# EAGLE design AnimatronicMouth (EAGLE 9.6.2)
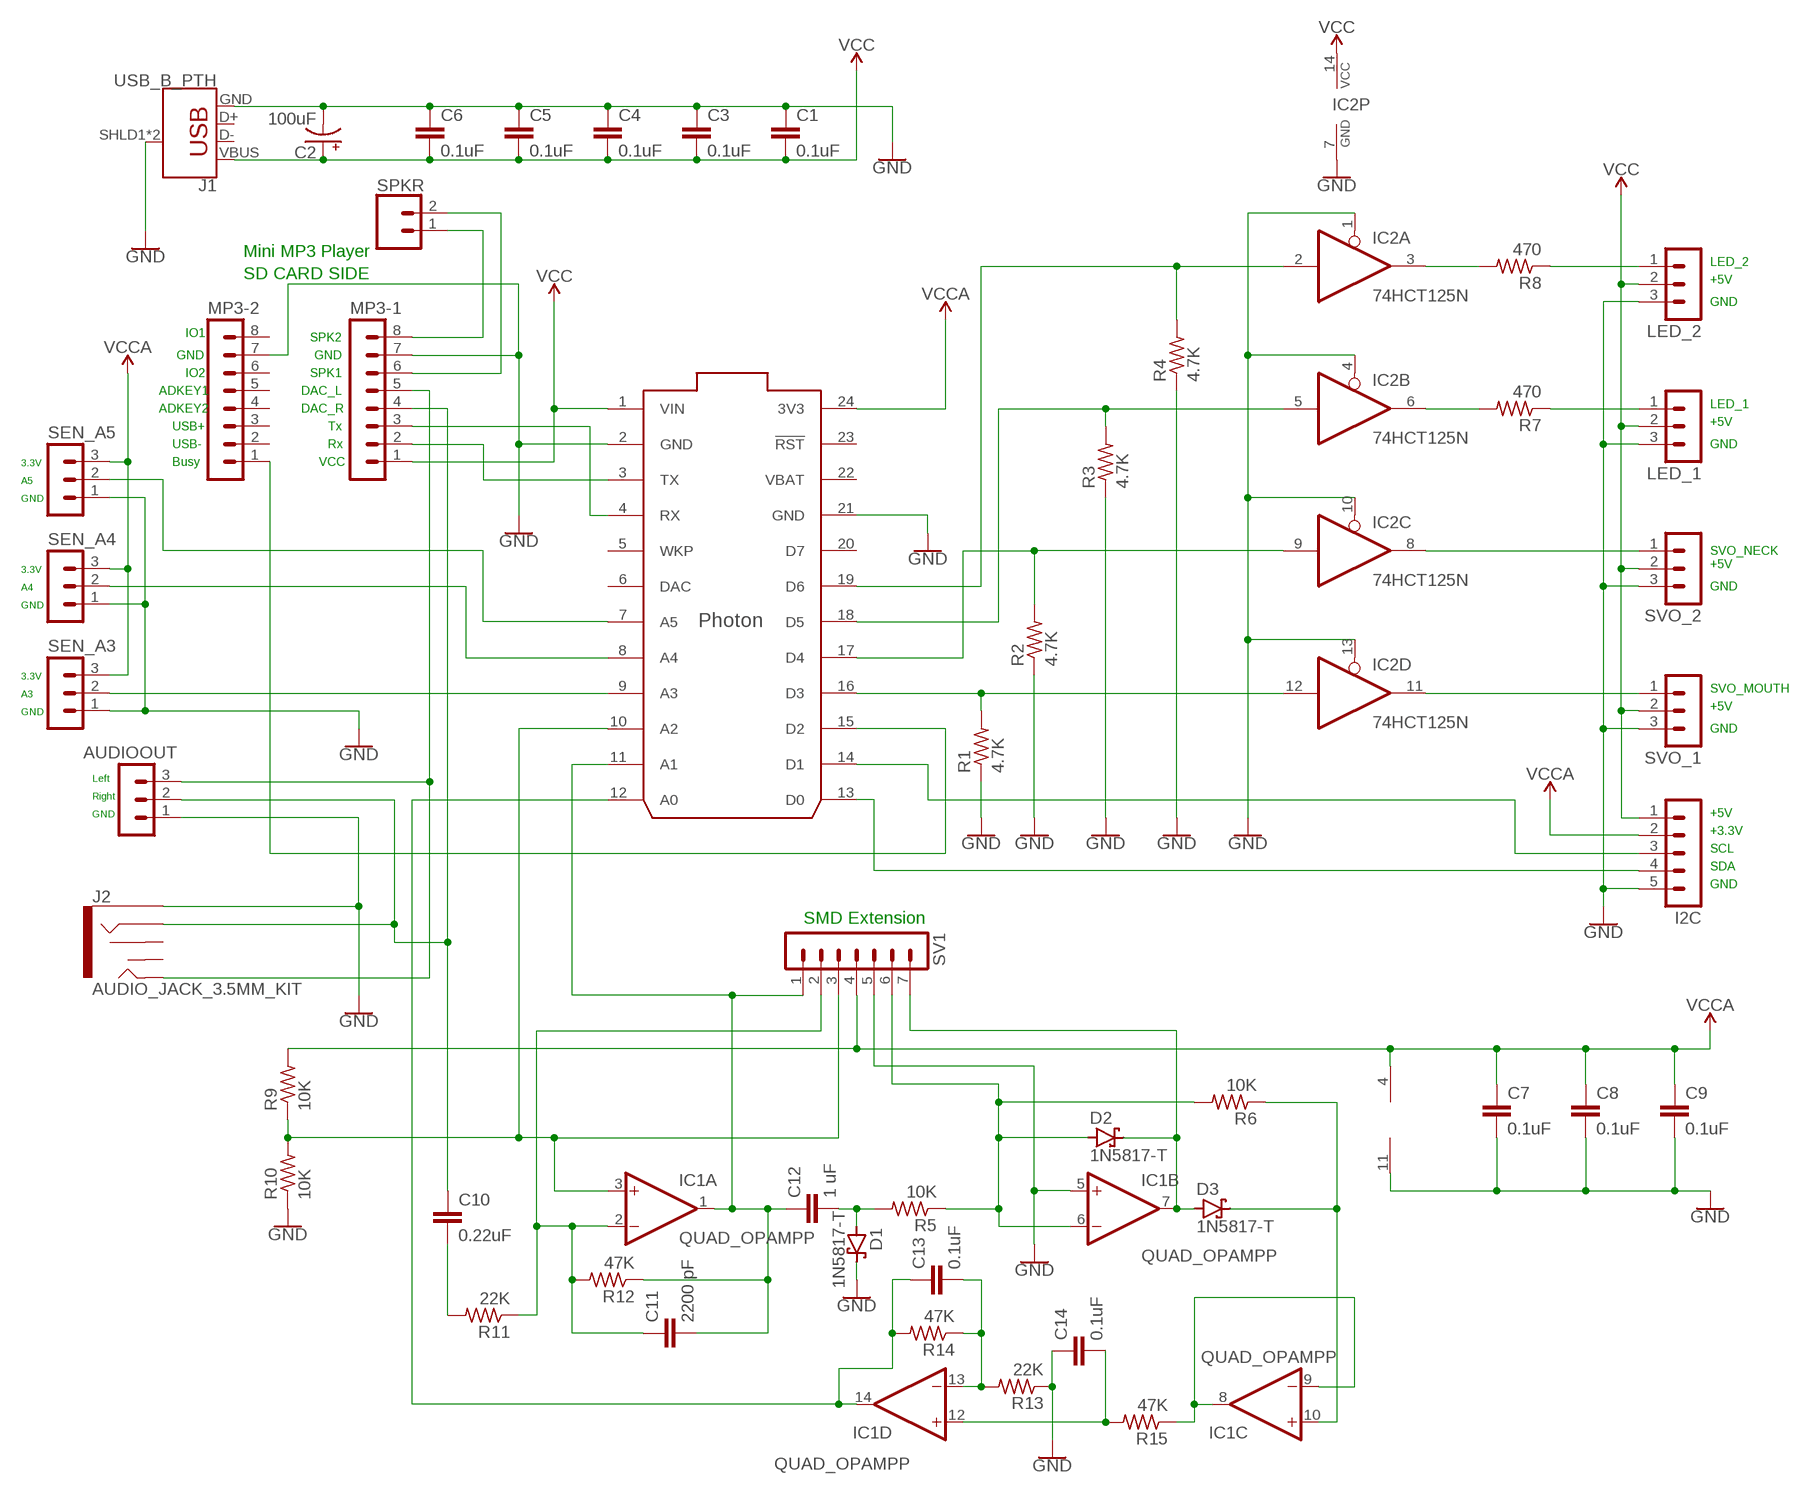
[diagram p0: schematic, sheet 1]

## Parts
AUDIOOUT  MA03-1  [MA03-1]
C1  0.1uF  0.1UF-KIT-EZ-50V-20%  [CAP-PTH-SMALL-KIT]
C2  100uF  100UF-POLAR-RADIAL-2.5MM-25V-20%  [CPOL-RADIAL-2.5MM-6.5MM]
C3  0.1uF  0.1UF-KIT-EZ-50V-20%  [CAP-PTH-SMALL-KIT]
C4  0.1uF  0.1UF-KIT-EZ-50V-20%  [CAP-PTH-SMALL-KIT]
C5  0.1uF  0.1UF-KIT-EZ-50V-20%  [CAP-PTH-SMALL-KIT]
C6  0.1uF  0.1UF-KIT-EZ-50V-20%  [CAP-PTH-SMALL-KIT]
C7  0.1uF  0.1UF-KIT-EZ-50V-20%  [CAP-PTH-SMALL-KIT]
C8  0.1uF  0.1UF-KIT-EZ-50V-20%  [CAP-PTH-SMALL-KIT]
C9  0.1uF  0.1UF-KIT-EZ-50V-20%  [CAP-PTH-SMALL-KIT]
C10  0.22uF  0.1UF-KIT-EZ-50V-20%  [CAP-PTH-SMALL-KIT]
C11  2200 pF  0.1UF-KIT-EZ-50V-20%  [CAP-PTH-SMALL-KIT]
C12  1 uF  0.1UF-KIT-EZ-50V-20%  [CAP-PTH-SMALL-KIT]
C13  0.1uF  0.1UF-KIT-EZ-50V-20%  [CAP-PTH-SMALL-KIT]
C14  0.1uF  0.1UF-KIT-EZ-50V-20%  [CAP-PTH-SMALL-KIT]
D1  1N5817-T  [DO41-7.6]
D2  1N5817-T  [DO41-7.6]
D3  1N5817-T  [DO41-7.6]
I2C  MA05-1  [MA05-1]
IC1  QUAD_OPAMPP  [DIL14]
IC2  74HCT125N  [DIL14]
J1  USB_B_PTH  [USB-B-PTH]
J2  AUDIO_JACK_3.5MM_KIT  [AUDIO-JACK-KIT]
LED_1  MA03-1  [MA03-1]
LED_2  MA03-1  [MA03-1]
MP3-1  MA08-1  [MA08-1]
MP3-2  MA08-1  [MA08-1]
R1  4.7K  R-US_0309/12  [0309/12]
R2  4.7K  R-US_0309/12  [0309/12]
R3  4.7K  R-US_0309/12  [0309/12]
R4  4.7K  R-US_0309/12  [0309/12]
R5  10K  R-US_0309/12  [0309/12]
R6  10K  R-US_0309/12  [0309/12]
R7  470  R-US_0309/12  [0309/12]
R8  470  R-US_0309/12  [0309/12]
R9  10K  R-US_0309/12  [0309/12]
R10  10K  R-US_0309/12  [0309/12]
R11  22K  R-US_0309/12  [0309/12]
R12  47K  R-US_0309/12  [0309/12]
R13  22K  R-US_0309/12  [0309/12]
R14  47K  R-US_0309/12  [0309/12]
R15  47K  R-US_0309/12  [0309/12]
SEN_A3  MA03-1  [MA03-1]
SEN_A4  MA03-1  [MA03-1]
SEN_A5  MA03-1  [MA03-1]
SPKR  CONN_023.5MM  [SCREWTERMINAL-3.5MM-2]
SV1  MA07-1  [MA07-1]
SVO_1  MA03-1  [MA03-1]
SVO_2  MA03-1  [MA03-1]
U$1  PHOTON_WITH_HEADERS  [PHOTON]

## Nets
GND: AUDIOOUT.1 C1.1 C2.2(-) C3.1 C4.1 C5.1 C6.1 C7.2 C8.2 C9.2 C14.1 D1.C I2C.5 IC1.5(B:+IN) IC1.11(P:V-) IC2.1(A:OE) IC2.4(B:OE) IC2.7(P:GND) IC2.10(C:OE) IC2.13(D:OE) J1.GND J1.SHLD1(SHIELD) J1.SHLD2(SHIELD) J2.SLEEVE LED_1.3 LED_2.3 MP3-1.7 MP3-2.7 R1.1 R2.1 R3.1 R4.1 R10.1 R13.1 SEN_A3.1 SEN_A4.1 SEN_A5.1 SV1.5 SVO_1.3 SVO_2.3 U$1.2(GND) U$1.21(GND)
N$1: IC2.12(D:I) R1.2 U$1.16(D3)
N$2: IC2.5(B:I) R3.2 U$1.18(D5)
N$3: IC2.9(C:I) R2.2 U$1.17(D4)
N$4: IC2.2(A:I) R4.2 U$1.19(D6)
N$5: IC2.11(D:O) SVO_1.1
N$6: LED_2.1 R8.1
N$7: IC2.8(C:O) SVO_2.1
N$8: LED_1.1 R7.1
N$9: IC2.6(B:O) R7.2
N$10: I2C.4 U$1.13(D0)
N$11: IC2.3(A:O) R8.2
N$12: MP3-1.6 SPKR.2
N$13: C11.2 C12.1 IC1.1(A:OUT) R12.1 SV1.1 U$1.11(A1)
N$14: IC1.3(A:+IN) R9.1 R10.2 SV1.3 U$1.10(A2)
N$15: AUDIOOUT.2 C10.1 J2.RING MP3-1.4
N$16: C12.2 D1.A R5.2
N$17: D2.A IC1.6(B:-IN) R5.1 R6.2 SV1.6
N$18: D2.C D3.A IC1.7(B:OUT) SV1.7
N$19: C13.1 IC1.14(D:OUT) R14.2 U$1.12(A0)
N$20: C10.2 R11.2
N$21: C11.1 IC1.2(A:-IN) R11.1 R12.2 SV1.2
N$22: MP3-1.2 U$1.3(TX)
N$23: MP3-1.3 U$1.4(RX)
N$24: MP3-2.1 U$1.15(D2)
N$25: AUDIOOUT.3 J2.TIP MP3-1.5
N$26: I2C.3 U$1.14(D1)
N$27: MP3-1.8 SPKR.1
N$28: SEN_A5.2 U$1.7(A5)
N$29: D3.C IC1.10(C:+IN) R6.1
N$30: SEN_A3.2 U$1.9(A3)
N$31: SEN_A4.2 U$1.8(A4)
N$33: C13.2 IC1.13(D:-IN) R13.2 R14.1
N$34: C14.2 IC1.12(D:+IN) R15.2
N$35: IC1.8(C:OUT) IC1.9(C:-IN) R15.1
VCC: C1.2 C2.1(+) C3.2 C4.2 C5.2 C6.2 I2C.1 IC2.14(P:VCC) J1.VBUS LED_1.2 LED_2.2 MP3-1.1 SVO_1.2 SVO_2.2 U$1.1(VIN)
VCCA: C7.1 C8.1 C9.1 I2C.2 IC1.4(P:V+) R9.2 SEN_A3.3 SEN_A4.3 SEN_A5.3 SV1.4 U$1.24(3V3)
Unconnected: J1.D+ J1.D- J2.RSH J2.TSH MP3-2.2 MP3-2.3 MP3-2.4 MP3-2.5 MP3-2.6 MP3-2.8 U$1.5(WKP) U$1.6(DAC) U$1.20(D7) U$1.23(!RST)

## Notes on the sheet
- Mini MP3 Player
- LED_2
- SD CARD SIDE
- +5V
- GND
- IO1
- SPK2
- GND | GND
- IO2 | SPK1
- ADKEY1 | DAC_L
- LED_1
- ADKEY2 | DAC_R
- +5V
- USB+ | Tx
- USB- | Rx | GND
- 3.3V | Busy | VCC
- A5
- GND
- SVO_NECK
- +5V
- 3.3V
- A4 | GND
- GND
- 3.3V
- SVO_MOUTH
- A3
- +5V
- GND
- GND
- Left
- Right
- GND | +5V
- +3.3V
- SCL
- SDA
- GND
- SMD Extension

## Power pins joined to a net without a drawn wire
VBAT: U$1.22(VBAT)

## Library data of the parts
AUDIOOUT LED_1 LED_2 SEN_A3-SEN_A5 SVO_1 SVO_2 = con-lstb:MA03-1: PIN HEADER; OC_FARNELL: unknown; OC_NEWARK: unknown
C1 C3-C9 C13 C14 = SparkFun-Capacitors:0.1UF: 0.1µF ceramic capacitors A capacitor is a passive two-terminal electrical component used to store electrical energy temporarily in an electric field.; PROD_ID: CAP-08370
C2 = SparkFun-Capacitors:100UF-POLAR: 100µF polarized capacitors A capacitor is a passive two-terminal electrical component used to store electrical energy temporarily in an electric field.; PROD_ID: CAP-08439
C10-C12 = SparkFun-Capacitors:0.1UF: 0.1µF ceramic capacitors A capacitor is a passive two-terminal electrical component used to store electrical energy temporarily in an electric field.; PROD_ID: CAP-08370; VALUE: 0.1uF
D1-D3 = diode:1N581*: 1.0A SCHOTTKY BARRIER RECTIFIER Source: http://www.diodes.com/datasheets/ds23001.pdf
I2C = con-lstb:MA05-1: PIN HEADER; OC_FARNELL: unknown; OC_NEWARK: unknown
IC1 = adafruit:QUAD_OPAMP: OP AMP Standard quad package
IC2 = 74xx-eu:74*125: Quad bus BUFFER, 3-state
J1 = SparkFun-Connectors:USB_B: USB Type B Connector SparkFun Products: SparkFun Stepoko <https://www.sparkfun.com/products/13899> PTH; PROD_ID: CONN-08278; SF_ID: PRT-00139
J2 = SparkFun-Connectors:AUDIO_JACK_3.5MM: Audio Jack 3.5mm variants of PTH and SMT stereo audio jack with bypass switches. SparkFun Products: SparkFun SparkPunk Sound Kit <[https://www.sparkfun.com/products/11177]> - PTH MP3 Trigger <https://www.sparkfun.com/products/13720> -3.5mm SMD SparkFun PicoBoard <https://www.sparkfun.com/products/11888>- 2.5mm SMD; PROD_ID: CONN-08774; SF_ID: PRT-08032
MP3-1 MP3-2 = con-lstb:MA08-1: PIN HEADER; OC_FARNELL: unknown; OC_NEWARK: unknown
R1-R15 = rcl:R-US_: RESISTOR, American symbol; SPICEPREFIX: R
SPKR = SparkFun-Connectors:CONN_02: Multi connection point. Often used as Generic Header-pin footprint for 0.1 inch spaced/style header connections On any of the 0.1 inch spaced packages, you can populate with these: Break Away Headers - Straight <https://www.sparkfun.com/products/116> (PRT-00116) Break Away Male Headers - Right Angle <https://www.sparkfun.com/products/553> (PRT-00553) Female Headers <https://www.sparkfun.com/products/115> (PRT-00115) Break Away Headers - Machine Pin <https://www.sparkfun.com/products/117> (PRT-00117) Break Away Female Headers - Swiss Machine Pin <https://www.sparkfun.com/products/743> (PRT-00743) For SCREWTERMINALS and SPRING TERMINALS visit here: Screw Terimnals on SparkFun.com <https://www.sparkfun.com/search/results?term=Screw+Terminals> (5mm/3.5mm/2.54mm spacing) This device is also useful as a general connection point to wire up your design to another part of your project. Our various solder wires solder well into these plated through hole pads. Hook-Up Wire - Assortment (Stranded, 22 AWG) <https://www.sparkfun.com/products/11375> (PRT-11375) Hook-Up Wire - Assortment (Solid Core, 22 AWG) <https://www.sparkfun.com/products/11367> (PRT-11367) View the entire wire category on our website here <https://www.sparkfun.com/categories/141> Special notes: Molex polarized connector foot print use with: PRT-08233 with associated crimp pins and housings. 2.54_SCREWTERM for use with PRT-10571. 3.5mm Screw Terminal footprints for PRT-08084 5mm Screw Terminal footprints for use with PRT-08432; PROD_ID: CONN-08399
SV1 = con-lstb:MA07-1: PIN HEADER; OC_FARNELL: unknown; OC_NEWARK: unknown
U$1 = Particle-Devices:PHOTON: Particle Photon Wi-Fi through-hole development board footprint Product datasheet: here <https://docs.particle.io/datasheets/photon-(wifi)/photon-datasheet/> Design files: here <https://github.com/particle-iot/photon> Github : Particle devices library <https://github.com/particle-iot/hardware-libraries/tree/master/Eagle>

## Board
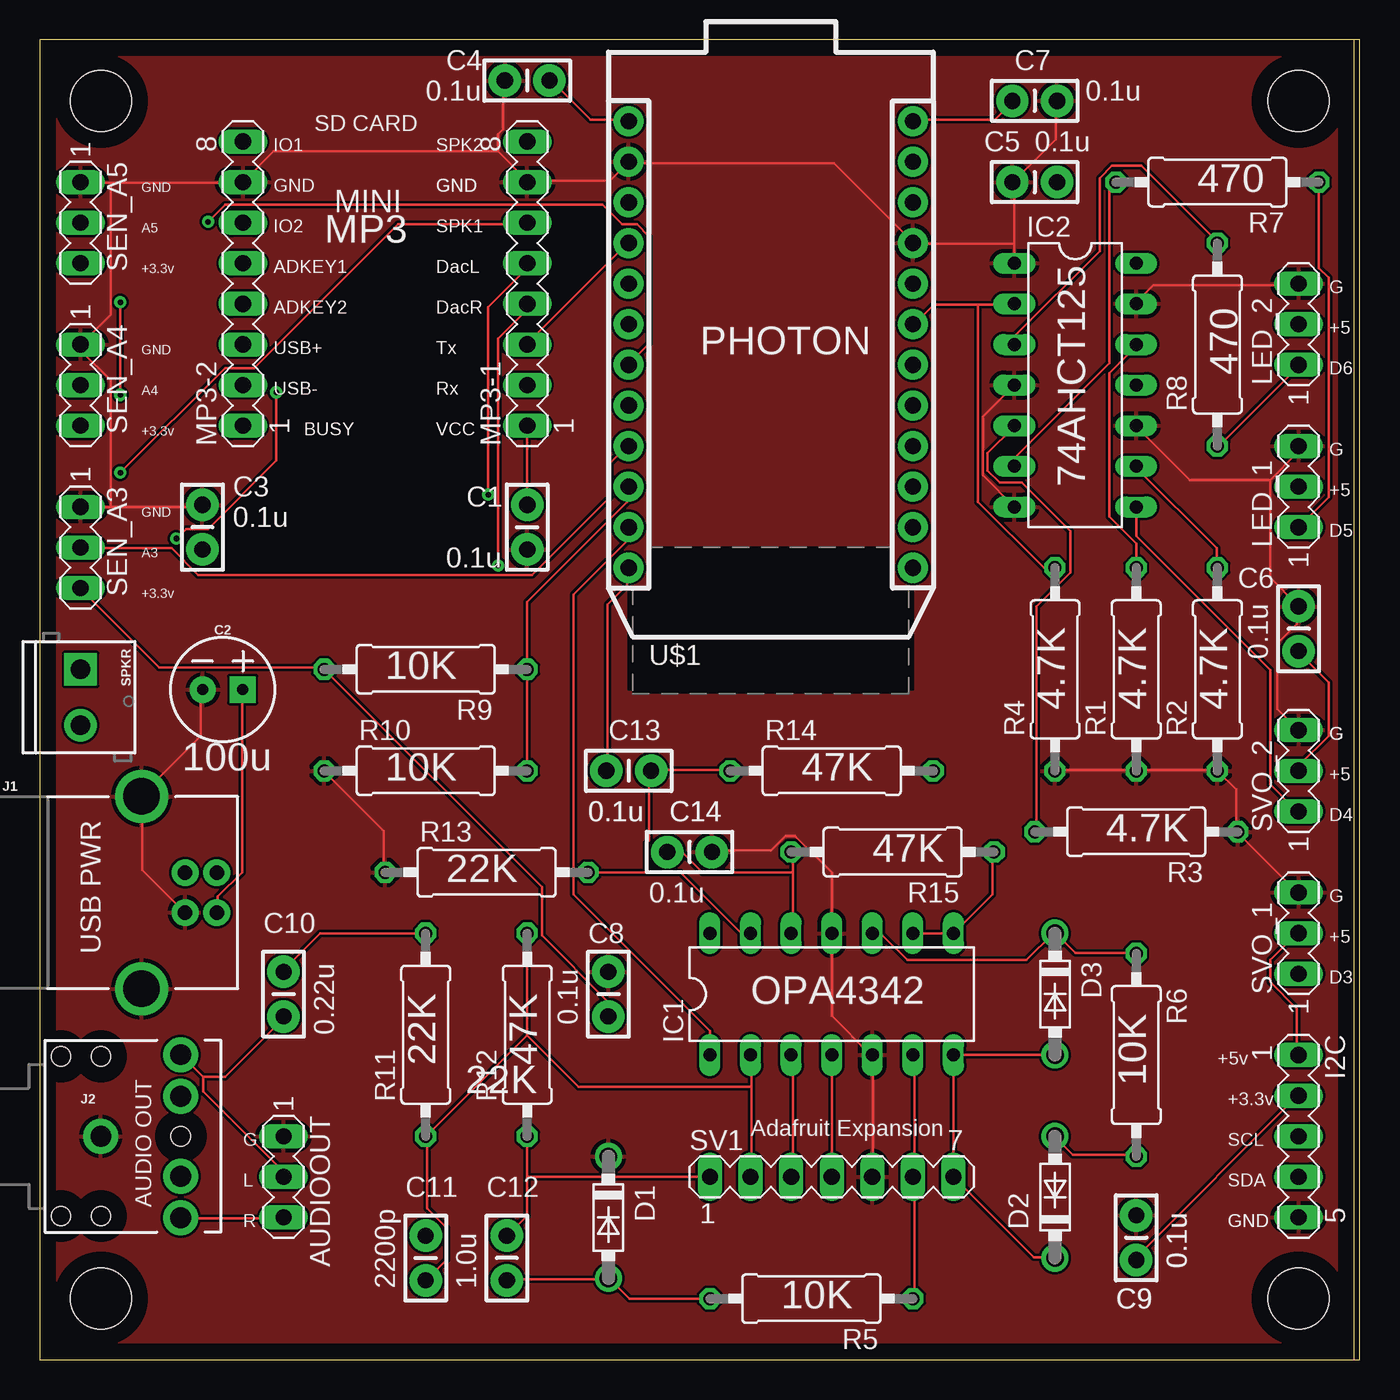
[diagram p1: board, top side]
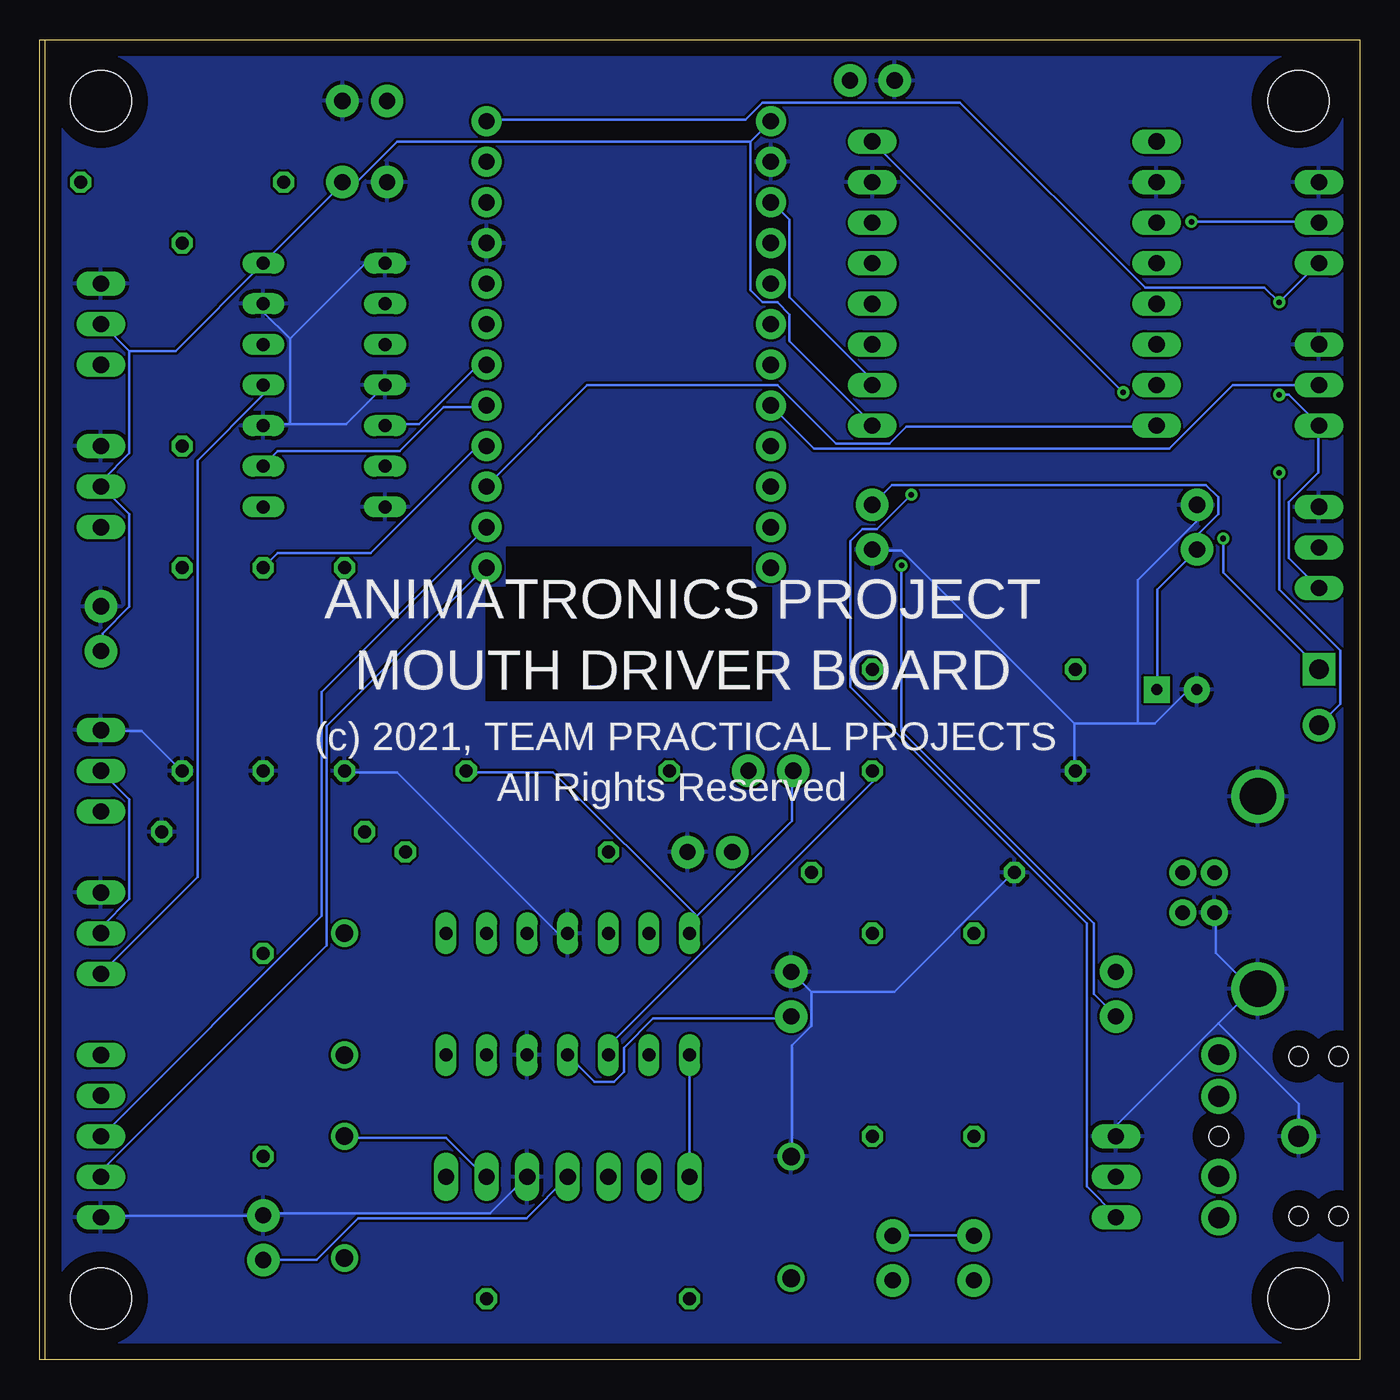
[diagram p2: board, bottom side, seen from below]

Size 82.55 x 82.55 mm. Coordinates in mm from the lower left corner, seen from the top.
Outline: 82.22,0 0,0 0,82.54 0,82.55 82.55,82.55 82.55,0 82.22,0
Outline: 82.22,0 82.22,82.54
Copper layers (1*16): Top 0.035mm / dielectric 1.5mm / Bottom 0.035mm
Design rules "default": minimum track width 6mil, minimum drill 0.35mm, track to track 6mil, track to pad 6mil, pad to pad 6mil, via to via 6mil, smd to smd 6mil, copper to edge 40mil, drill to drill 6mil, minimum pad ring 10mil, minimum via ring 8mil, stop-mask expansion 4mil, vias tented up to drill 0mil, thermal gap 10mil
Holes 3.8 mm at 3.81,78.74 3.81,3.81 78.74,3.81 78.74,78.74
tRestrict: area 53.3,41.9 to 54.6,48.3; area 36.8,41.9 to 54.6,50.8
bRestrict: area 36.8,41.3 to 54.6,50.8

### Footprints (pad centres in the part's own frame; a part is rotated, then mirrored left to right if it is on the bottom)
MA03-1 = drill 1.016 long: 1 -2.54,0; 2 0,0; 3 2.54,0
CAP-PTH-SMALL-KIT = drill 1.016 pad 2.032: 1 -1.397,0; 2 1.397,0
CPOL-RADIAL-2.5MM-6.5MM = drill 0.7 pad 1.651 square: 1 1.25,0 | drill 0.7 pad 1.651: 2 -1.25,0
DO41-7.6 = drill 1.1 pad 1.7: A 3.81,0; C -3.81,0
MA05-1 = drill 1.016 long: 1 -5.08,0; 2 -2.54,0; 3 0,0; 4 2.54,0; 5 5.08,0
DIL14 = drill 0.813 long: 1 -7.62,-3.81; 2 -5.08,-3.81; 3 -2.54,-3.81; 4 0,-3.81; 5 2.54,-3.81; 6 5.08,-3.81; 7 7.62,-3.81; 8 7.62,3.81; 9 5.08,3.81; 10 2.54,3.81; 11 0,3.81; 12 -2.54,3.81; 13 -5.08,3.81; 14 -7.62,3.81
USB-B-PTH = drill 0.914 pad 1.676: D+ 4,1.25; D- 5.981,1.25; GND 4,-1.25; VBUS 5.981,-1.25 | drill 2.286: SHLD1 1.282,-6.02; SHLD2 1.282,6.02
AUDIO-JACK-KIT = drill 1.3 pad 2.184: RING 5,5.1; RSH 5,2.5; SLEEVE 0,0; TIP 5,-5.1; TSH 5,-2.5 | hole 1.2: 0,5; -2.5,5; -2.5,-5; 0,-5; 5,0
MA08-1 = drill 1.016 long: 1 -8.89,0; 2 -6.35,0; 3 -3.81,0; 4 -1.27,0; 5 1.27,0; 6 3.81,0; 7 6.35,0; 8 8.89,0
0309/12 = drill 0.813 octagon: 1 -6.35,0; 2 6.35,0
SCREWTERMINAL-3.5MM-2 = drill 1.2 pad 2.032 square: 1 0,0 | drill 1.2 pad 2.032: 2 3.5,0
MA07-1 = drill 1.016 long: 1 -7.62,0; 2 -5.08,0; 3 -2.54,0; 4 0,0; 5 2.54,0; 6 5.08,0; 7 7.62,0
PHOTON = drill 1.016 pad 1.88: 1 1.27,33.02; 2 1.27,30.48; 3 1.27,27.94; 4 1.27,25.4; 5 1.27,22.86; 6 1.27,20.32; 7 1.27,17.78; 8 1.27,15.24; 9 1.27,12.7; 10 1.27,10.16; 11 1.27,7.62; 12 1.27,5.08; 13 19.05,5.08; 14 19.05,7.62; 15 19.05,10.16; 16 19.05,12.7; 17 19.05,15.24; 18 19.05,17.78; 19 19.05,20.32; 20 19.05,22.86; 21 19.05,25.4; 22 19.05,27.94; 23 19.05,30.48; 24 19.05,33.02

### Placement (x,y rotation side)
AUDIOOUT  15.24,11.43 270 top
C1  30.48,52.07 90 top
C2  11.43,41.91 0 top
C3  10.16,52.07 270 top
C4  30.48,80.01 0 top
C5  62.23,73.66 0 top
C6  78.74,45.72 270 top
C7  62.23,78.74 0 top
C8  35.56,22.86 90 top
C9  68.58,7.62 90 top
C10  15.24,22.86 90 top
C11  24.13,6.35 90 top
C12  29.21,6.35 270 top
C13  36.83,36.83 0 top
C14  40.64,31.75 180 top
D1  35.56,8.89 270 top
D2  63.5,10.16 90 top
D3  63.5,22.86 270 top
I2C  78.74,13.97 270 top
IC1  49.53,22.86 0 top
IC2  64.77,60.96 270 top
J1  5.08,29.21 0 top
J2  3.81,13.97 0 top
LED_1  78.74,54.61 90 top
LED_2  78.74,64.77 90 top
MP3-1  30.48,67.31 90 top
MP3-2  12.7,67.31 90 top
R1  68.58,43.18 90 top
R2  73.66,43.18 90 top
R3  68.58,33.02 180 top
R4  63.5,43.18 90 top
R5  48.26,3.81 180 top
R6  68.58,19.05 270 top
R7  73.66,73.66 180 top
R8  73.66,63.5 90 top
R9  24.13,43.18 180 top
R10  24.13,36.83 0 top
R11  24.13,20.32 90 top
R12  30.48,20.32 90 top
R13  27.94,30.48 0 top
R14  49.53,36.83 0 top
R15  53.34,31.75 180 top
SEN_A3  2.54,50.8 270 top
SEN_A4  2.54,60.96 270 top
SEN_A5  2.54,71.12 270 top
SPKR  2.54,43.18 270 top
SV1  49.53,11.43 0 top
SVO_1  78.74,26.67 90 top
SVO_2  78.74,36.83 90 top
U$1  35.56,44.45 0 top

### Tracks (layer width: path | path; a pad name or v marks a point on that pad's centre or on a via)
GND
  Top 0.152: 30.48,73.76 35.66,73.76 U$1.2 36.88,74.83 49.68,74.83 54.56,69.95 U$1.21 54.71,69.8 60.96,69.8 | 28.65,75.59 28.65,76.66 28.96,76.96 28.96,80.01 C4.1 | 30.48,73.76 28.65,75.59 | 30.48,73.76 MP3-1.7 | 4.42,73.61 12.65,73.61 MP3-2.7 14.63,75.59 28.65,75.59 | 4.42,73.61 2.59,73.61 SEN_A5.1 | 4.42,53.34 10.06,53.34 C3.1 | 4.42,53.34 SEN_A3.1 | 4.42,53.34 4.42,61.27 2.59,63.09 2.59,63.4 SEN_A4.1 4.42,65.38 4.42,73.61 | C2.2 10.06,41.91 10.06,39.01 6.4,35.36 J1.SHLD2 6.4,35.2 6.4,30.63 8.99,28.04 J1.GND | R13.1 21.49,30.48 21.49,33.07 17.83,36.73 R10.1 | SV1.5 52.12,11.43 52.12,19.05 IC1.5 51.97,19.05 49.53,21.49 IC1.11 49.53,30.48 47.24,32.77 46.63,32.77 45.72,31.85 42.06,31.85 C14.1 | 76.96,55.02 78.64,56.69 78.64,57.15 LED_1.3 | 76.96,55.02 76.96,48.92 78.64,47.24 C6.1 78.64,47.09 78.64,46.02 77.42,44.81 77.42,40.69 SVO_2.3 | 68.58,36.88 63.55,36.88 R4.1 | SVO_1.3 78.64,29.26 74.98,32.92 R3.1 74.83,33.07 74.83,35.66 R2.1 73.61,36.88 68.58,36.88 | 68.58,36.88 R1.1 | 60.96,69.8 60.96,73.61 C5.1 60.96,73.76 63.55,76.35 63.55,78.64 C7.2 | 60.96,69.8 IC2.1 | IC2.7 58.98,55.32 58.98,58.98 IC2.4 | LED_2.3 78.64,67.21 69.65,67.21 68.58,66.14 IC2.13 | 76.96,55.02 71.93,55.02 68.58,58.37 IC2.10
  Bottom 0.152: AUDIOOUT.1 15.24,14.63 8.84,21.03 | 6.71,23.16 8.84,21.03 | 6.71,23.16 6.4,23.16 J1.SHLD1 6.71,23.16 | 6.71,23.16 8.99,25.45 8.99,27.89 J1.GND | J2.SLEEVE 3.81,16 8.84,21.03 | 34.29,23.01 34.29,20.88 35.51,19.66 35.51,12.8 D1.C | 34.29,23.01 35.51,24.23 C8.2 | 17.83,39.78 28.65,50.6 30.48,50.6 C1.1 | 17.83,39.78 17.83,36.88 R10.1 | 34.29,23.01 29.11,23.01 21.64,30.48 R13.1 | C2.2 10.67,41.91 12.8,39.78 13.87,39.78 | 17.83,39.78 13.87,39.78 | 13.87,39.78 13.87,48.77 10.21,52.43 10.21,53.34 C3.1 | I2C.5 78.64,8.99 68.58,8.99 C9.2 68.58,9.14 54.41,9.14 52.12,11.43 SV1.5 | SVO_2.3 78.64,39.32 76.2,39.32 73.76,36.88 R2.1 | 66.9,58.52 63.4,58.52 IC2.4 | 66.9,58.52 68.58,58.52 IC2.10 | IC2.13 68.58,65.53 66.9,63.86 | 66.9,58.52 66.9,63.86 | IC2.1 62.18,68.58 66.9,63.86 | IC1.11 50.14,26.67 60.2,36.73 63.4,36.73 R4.1
  pour Top: 0,82.55 0,0 82.55,0 82.55,82.55
  pour Bottom: 0,82.55 0,0 82.55,0 82.55,82.55
N$1
  Top 0.152: R1.2 68.58,51.05 66.9,52.73 66.9,61.72 68.58,63.4 IC2.12
  Bottom 0.152: U$1.16 55.17,57.15 61.87,50.44 67.67,50.44 R1.2
N$2
  Top 0.152: R3.2 62.33,33.07 62.33,47.09 64.47,49.23 64.47,51.82 61.42,54.86 60.05,54.86 59.28,55.63 59.28,56.69 60.96,58.37 IC2.5
  Bottom 0.152: IC2.5 60.96,58.52 58.83,58.52 55.17,62.18 54.71,62.18 U$1.18
N$3
  Top 0.152: R2.2 73.61,49.53 73.61,50.75 68.58,55.78 IC2.9
  Bottom 0.152: U$1.17 54.71,59.59 57.3,59.59 60.05,56.84 67.67,56.84 68.58,55.93 IC2.9
N$4
  Top 0.152: 58.67,65.99 55.93,65.99 54.71,64.77 U$1.19 | 58.67,65.99 60.96,65.99 IC2.2 | R4.2 62.79,49.53 58.67,53.65 58.67,65.99
N$5
  Bottom 0.152: IC2.11 68.58,60.35 72.69,56.24 72.69,30.18 SVO_1.1
N$6
  Top 0.152: R8.1 73.76,57.15 78.79,62.18 LED_2.1
N$7
  Top 0.152: IC2.8 68.58,51.51 76.96,43.13 76.96,35.97 78.64,34.29 SVO_2.1
N$8
  Top 0.152: R7.1 80.01,68.28 80.62,67.67 80.62,53.95 LED_1.1
N$9
  Top 0.152: IC2.6 60.96,56.39 66.9,62.33 66.9,73.3 67.21,73.61 R7.2
N$10
  Bottom 0.152: I2C.4 78.64,11.43 78.64,11.89 64.62,25.91 64.62,39.62 54.71,49.53 U$1.13
N$11
  Top 0.152: IC2.3 60.96,64.01 66.29,69.34 66.29,73.91 67.06,74.68 68.89,74.68 73.61,69.95 R8.2
N$12  (via drill 0.35)
  Top 0.152: v5.03,55.47 11.58,62.03 13.41,62.03 22.4,71.02 30.48,71.02 MP3-1.6
  Bottom 0.152: v5.03,55.47 5.03,48.16 1.22,44.35 1.22,41 2.44,39.78 SPKR.2
N$13
  Top 0.152: 30.48,11.43 30.48,8.99 29.26,7.77 C12.1 | 30.48,11.43 R12.1 | IC1.1 41.91,20.57 33.38,29.11 33.38,47.85 36.73,51.21 36.73,51.97 U$1.11 | SV1.1 30.48,11.43
  Bottom 0.152: C11.2 24.23,7.77 29.11,7.77 C12.1 | SV1.1 IC1.1
N$14
  Top 0.152: IC1.3 47.09,19.05 47.09,11.43 SV1.3 | R10.2 R9.1 30.48,47.4 36.73,53.65 36.73,54.56 U$1.10
  Bottom 0.152: R10.2 30.48,36.12 46.94,19.66 46.94,19.05 IC1.3
N$15  (via drill 0.35)
  Top 0.152: AUDIOOUT.2 15.24,11.73 10.21,16.76 10.21,17.68 | 10.21,17.68 8.84,19.05 J2.RING | MP3-1.4 30.48,65.68 28.65,63.86 v28.65,49.68 | 10.21,17.68 11.58,17.68 15.24,21.34 C10.1
  Bottom 0.152: v28.65,49.68 28.65,39.32 16.61,27.28 16.61,22.86 15.24,21.49 C10.1
N$16
  Top 0.152: R5.2 36.88,3.81 35.66,5.03 D1.A 35.51,5.03 29.26,5.03 C12.2
N$17
  Top 0.152: R6.2 68.58,12.8 64.62,12.8 63.55,13.87 D2.A | 54.71,11.43 54.71,3.81 R5.1 | 54.71,11.43 54.71,19.05 IC1.6 | 54.71,11.43 SV1.6
  Bottom 0.152: D2.A 63.4,13.87 57.15,13.87 54.71,11.43 SV1.6
N$18
  Top 0.152: D3.A IC1.7 SV1.7 62.18,6.4 63.4,6.4 D2.C
N$19
  Top 0.152: U$1.12 36.73,49.53 36.73,48.46 35.51,47.24 35.51,36.88 C13.1
  Bottom 0.152: 41.45,27.74 35.51,33.68 35.51,36.73 C13.1 | 41.45,27.74 41.91,27.28 IC1.14 41.45,27.74 | 41.45,27.74 50.44,36.73 55.78,36.73 R14.2
N$20
  Top 0.152: R11.2 17.53,26.67 15.24,24.38 C10.2
N$21
  Top 0.152: 44.5,17.07 44.5,11.43 SV1.2 | 44.5,17.07 44.5,19.05 IC1.2 | C11.1 24.23,5.03 25.45,6.25 25.45,8.23 24.23,9.45 24.23,13.87 R11.1 24.23,14.02 30.48,20.27 | 30.48,20.27 R12.2 | 44.5,17.07 33.68,17.07 30.48,20.27
N$22
  Bottom 0.152: MP3-1.2 30.48,61.27 35.66,66.45 35.66,71.32 36.73,72.39 U$1.3
N$23
  Top 0.152: MP3-1.3 30.48,63.55 36.73,69.8 U$1.4
N$24
  Bottom 0.152: MP3-2.1 12.8,58.37 28.35,58.37 29.41,57.3 32.77,57.3 36.42,60.96 48.31,60.96 54.56,54.71 U$1.15
N$25  (via drill 0.35)
  Top 0.152: AUDIOOUT.3 15.24,8.84 8.84,8.84 J2.TIP | MP3-1.5 30.48,68.28 28.04,65.84 v28.04,54.1
  Bottom 0.152: v28.04,54.1 30.18,51.97 31.09,51.97 31.85,51.21 31.85,42.06 17.07,27.28 17.07,10.82 15.24,8.99 AUDIOOUT.3
N$26
  Bottom 0.152: U$1.14 64.92,41.76 64.92,27.74 78.64,14.02 I2C.3
N$27  (via drill 0.35)
  Top 0.152: v14.78,60.5 14.78,56.24 10.52,51.97 9.14,51.97 v8.53,51.36
  Bottom 0.152: v14.78,60.5 MP3-1.8 | v8.53,51.36 8.53,49.23 2.59,43.28 SPKR.1
N$28  (via drill 0.35)
  Top 0.152: v10.52,71.17 11.58,72.24 35.2,72.24 36.42,71.02 37.34,71.02 38.1,70.26 38.1,63.55 36.88,62.33 U$1.7
  Bottom 0.152: v10.52,71.17 2.59,71.17 SEN_A5.2
N$29
  Top 0.152: R6.1 68.58,25.45 64.77,25.45 63.55,26.67 D3.C 63.4,26.67 61.72,24.99 54.25,24.99 52.58,26.67 IC1.10
N$30
  Top 0.152: SEN_A3.2 2.59,50.75 8.23,50.75 9.91,49.07 30.79,49.07 35.66,53.95 35.66,56.08 36.73,57.15 U$1.9
N$31
  Bottom 0.152: SEN_A4.2 7.92,60.96 11.89,57 34.14,57 U$1.8
N$33
  Top 0.152: R14.1 43.13,36.88 38.25,36.88 C13.2 38.1,36.73 38.1,32.46 37.95,32.31 37.95,30.48 | IC1.13 43.89,26.67 40.08,30.48 37.95,30.48 | R13.2 37.95,30.48
N$34
  Top 0.152: 47.09,30.48 47.09,31.7 R15.2 | 47.09,30.48 47.09,26.67 IC1.12 | 47.09,30.48 41.45,30.48 40.23,31.7 39.32,31.7 C14.2
N$35
  Top 0.152: IC1.9 IC1.8 59.59,29.11 59.59,31.7 R15.1
VCC
  Top 0.152: I2C.1 78.64,19.05 78.64,21.95 76.96,23.62 76.96,24.99 78.64,26.67 SVO_1.2 | SVO_2.2 78.79,36.88 78.79,37.19 80.62,39.01 80.62,42.37 78.79,44.2 C6.2 | J1.VBUS 11.12,28.04 11.12,28.96 12.65,30.48 12.65,41.91 C2.1 | C1.2 MP3-1.1 | U$1.1 36.73,77.57 34.44,77.57 32,80.01 C4.2
  Bottom 0.152: SVO_2.2 76.96,35.05 76.96,28.8 78.64,27.13 78.64,26.67 SVO_1.2 | 76.96,63.09 76.96,56.69 78.64,55.02 78.64,54.71 LED_1.2 78.64,54.56 76.96,52.88 76.96,47.09 78.64,45.41 78.64,44.35 C6.2 | 76.96,63.09 78.64,64.77 LED_2.2 | 76.96,63.09 74.07,63.09 IC2.14 63.55,73.61 C5.2 63.55,73.76 62.64,73.76 60.2,76.2 38.1,76.2 | C2.1 12.65,41.91 12.65,48.16 10.21,50.6 C3.2 10.06,50.75 10.06,51.66 8.84,52.88 8.84,53.95 9.6,54.71 29.26,54.71 30.48,53.49 C1.2 | 38.1,76.2 38.1,66.9 37.34,66.14 36.42,66.14 35.66,65.38 35.66,63.7 30.48,58.52 MP3-1.1 | U$1.1 38.1,76.2
VCCA  (via drill 0.35)
  Top 0.152: C9.1 68.58,6.4 78.64,16.46 I2C.2 | SV1.4 IC1.4 | U$1.24 54.71,77.57 59.74,77.57 60.81,78.64 C7.1 | SEN_A3.3 2.59,48.16 7.47,43.28 17.68,43.28 R9.2 31.39,29.57 31.39,26.52 35.51,22.4 35.51,21.49 C8.1 | v5.03,60.35 v5.03,66.14
  Bottom 0.152: IC1.4 47.85,17.37 46.63,17.37 46.02,17.98 46.02,19.51 44.2,21.34 35.66,21.34 C8.1 | SV1.4 52.12,8.84 62.64,8.84 65.23,6.25 68.58,6.25 C9.1 | SEN_A3.3 4.42,50.14 4.42,53.65 2.59,55.47 2.59,58.37 SEN_A4.3 2.59,58.52 4.42,60.35 v5.03,60.35 | SEN_A5.3 2.59,68.58 v5.03,66.14 5.94,67.06 13.41,67.06 24.99,78.64 37.34,78.64 38.41,77.57 54.56,77.57 U$1.24

### Text on the board
tPlace: C4 | C7 | 0.1u | 0.1u | SD CARD | IO1 | SPK2 | C5 | 0.1u | GND | GND | GND | GND | 470 | MINI | A5 | IO2 | MP3 | SPK1 | +3.3v | ADKEY1 | DacL | G | ADKEY2 | DacR | +5 | GND | USB+ | Tx | PHOTON | 470 | D6 | A4 | USB- | Rx | +3.3v | BUSY | VCC | G | 74AHCT125 | C3 | +5 | GND | C1 | 0.1u | D5 | A3 | 0.1u | +3.3v | C6 | 0.1u | 10K | 4.7K | 4.7K | 4.7K | C13 | G | G | 100u | 10K | 47K | +5 | 0.1u | 0.1u | C14 | C14 | D4 | 4.7K | 47K | 22K | 0.1u | G | C10 | C8 | +5 | USB PWR | D3 | OPA4342 | 0.1u | 0.22u | 22K | 22K | 47K | +5v | 10K | +3.3v | Adafruit Expansion | G | SCL | L | SDA | AUDIO OUT | C11 | C12 | R | GND | GND | 0.1u | 0.1u | 2200p | 1.0u | 10K | C9 | C9
bPlace: ANIMATRONICS PROJECT | MOUTH DRIVER BOARD | (c) 2021, TEAM PRACTICAL PROJECTS | All Rights Reserved